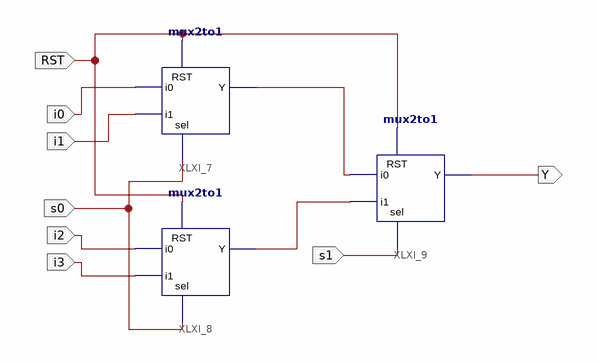
[diagram p0: schematic sheet 1]
// Xilinx ISE schematic mux4to1.sch (artix7) as structural Verilog: 3 symbols, 8 ports
module mux4to1 (
  input  i0,
  input  i1,
  input  i2,
  input  i3,
  input  s1,
  input  s0,
  input  RST,
  output Y
);

  wire XLXN_1, XLXN_2;

  mux2to1 XLXI_7 (.i0(i0), .i1(i1), .RST(RST), .sel(s0), .Y(XLXN_1));
  mux2to1 XLXI_8 (.i0(i2), .i1(i3), .RST(RST), .sel(s0), .Y(XLXN_2));
  mux2to1 XLXI_9 (.i0(XLXN_1), .i1(XLXN_2), .RST(RST), .sel(s1), .Y(Y));
endmodule
